# EAGLE design open-access-interlock (EAGLE 5.11)
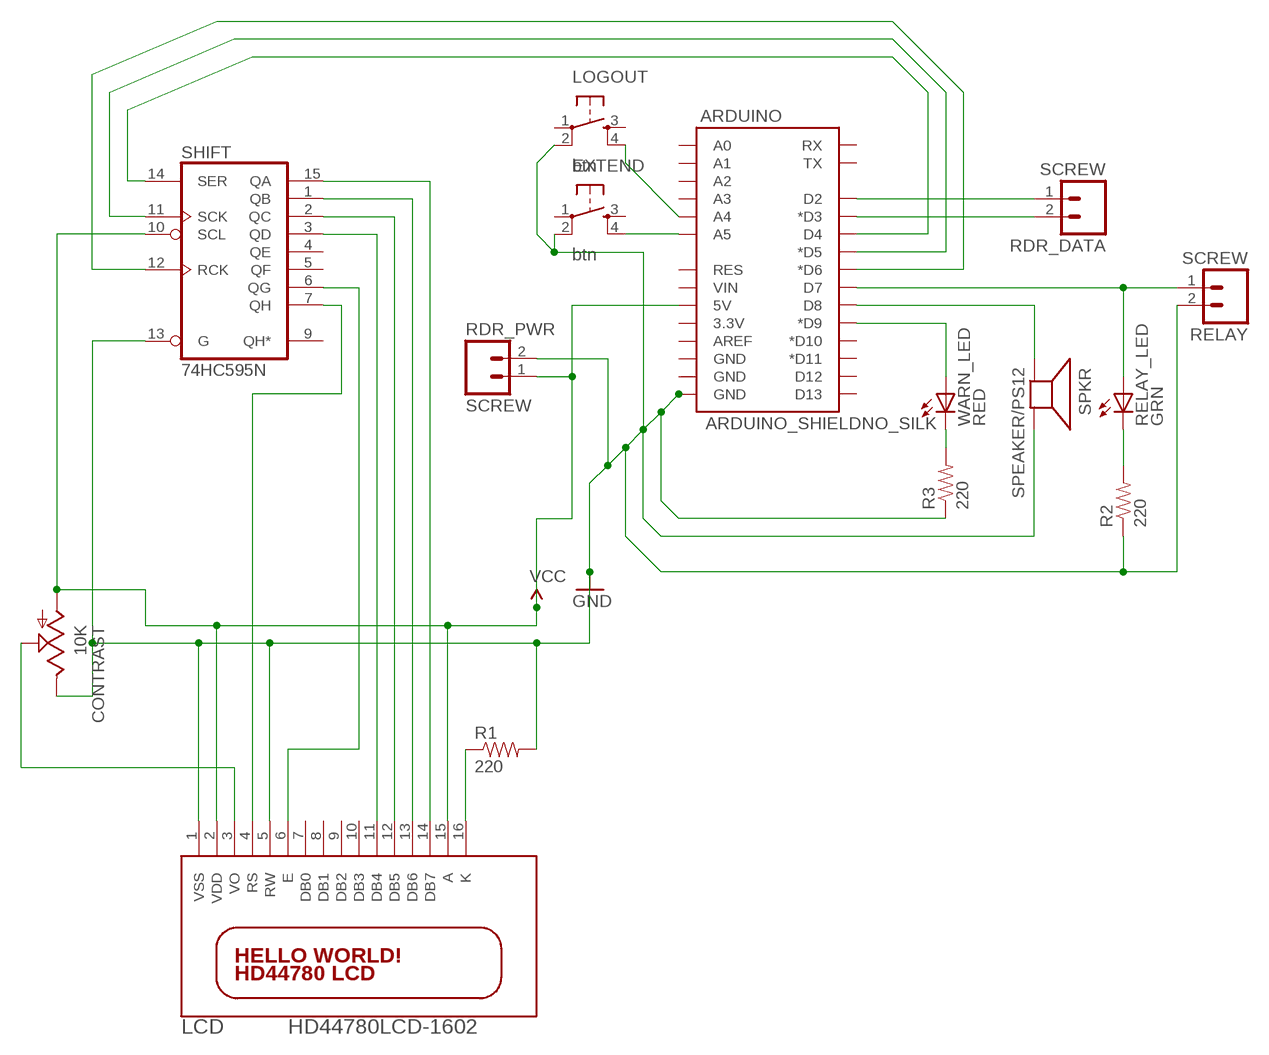
[diagram p0: schematic, sheet 1]

## Parts
ARDUINO  ARDUINO_SHIELDNO_SILK  [DUEMILANOVE_VIAS]
CONTRAST  10K  TRIM_US-RS3  [RS3]
EXTEND  btn  TAC_SWITCHPTH  [TACTILE-PTH]
LCD  HD44780LCD-1602  [LCD1602]
LOGOUT  btn  TAC_SWITCHPTH  [TACTILE-PTH]
R1  220  RESISTORAXIAL-0.3  [AXIAL-0.3]
R2  220  RESISTORAXIAL-0.3  [AXIAL-0.3]
R3  220  RESISTORAXIAL-0.3  [AXIAL-0.3]
RDR_DATA  SCREW  M023.5MM  [SCREWTERMINAL-3.5MM-2]
RDR_PWR  SCREW  M023.5MM  [SCREWTERMINAL-3.5MM-2]
RELAY  SCREW  M023.5MM  [SCREWTERMINAL-3.5MM-2]
RELAY_LED  GRN  LED5MM  [LED5MM]
SHIFT  74HC595N  [DIL16]
SPKR  SPEAKER/PS12  [PS12]
WARN_LED  RED  LED5MM  [LED5MM]

## Nets
GND: ARDUINO.GND@0(GND) CONTRAST.E EXTEND.2 LCD.1(VSS) LCD.5(RW) LOGOUT.2 R1.P$2 R2.P$1 R3.P$1 RDR_PWR.2 RELAY.2 SHIFT.13(G) SPKR.P$2(-)
N$1: ARDUINO.D2 RDR_DATA.1
N$2: ARDUINO.D3(*D3) RDR_DATA.2
N$3: LCD.13(DB6) SHIFT.1(QB)
N$4: LCD.12(DB5) SHIFT.2(QC)
N$5: ARDUINO.D4 SHIFT.14(SER)
N$6: ARDUINO.D6(*D6) SHIFT.12(RCK)
N$7: ARDUINO.D5(*D5) SHIFT.11(SCK)
N$8: ARDUINO.D7 RELAY.1 RELAY_LED.A
N$9: ARDUINO.D9(*D9) WARN_LED.A
N$10: ARDUINO.D8 SPKR.P$1(+)
N$11: LCD.6(E) SHIFT.6(QG)
N$12: LCD.11(DB4) SHIFT.3(QD)
N$14: ARDUINO.A4 LOGOUT.4
N$15: ARDUINO.A5 EXTEND.4
N$17: LCD.4(RS) SHIFT.7(QH)
N$18: CONTRAST.S LCD.3(VO)
N$19: LCD.16(K) R1.P$1
N$20: LCD.14(DB7) SHIFT.15(QA)
N$22: R3.P$2 WARN_LED.K(C)
N$23: R2.P$2 RELAY_LED.K(C)
VCC: ARDUINO.5V CONTRAST.A LCD.2(VDD) LCD.15(A) RDR_PWR.1 SHIFT.10(SCL)
Unconnected: ARDUINO.3.3V ARDUINO.A0 ARDUINO.A1 ARDUINO.A2 ARDUINO.A3 ARDUINO.AREF ARDUINO.D10(*D10) ARDUINO.D11(*D11) ARDUINO.D12 ARDUINO.D13 ARDUINO.GND@1(GND) ARDUINO.GND@2(GND) ARDUINO.RES ARDUINO.RX ARDUINO.TX ARDUINO.VIN EXTEND.1 EXTEND.3 LCD.7(DB0) LCD.8(DB1) LCD.9(DB2) LCD.10(DB3) LOGOUT.1 LOGOUT.3 SHIFT.4(QE) SHIFT.5(QF) SHIFT.9(QH*)

## Power pins joined to a net without a drawn wire
GND: SHIFT.8(GND)
VCC: SHIFT.16(VCC)

## Library data of the parts
ARDUINO = SparkFun:ARDUINO_SHIELD
CONTRAST = pot:TRIM_US-: POTENTIOMETER
EXTEND LOGOUT = SparkFun:TAC_SWITCH: Momentary Switch Button commonly used for reset or general input. Spark Fun Electronics SKU : COM-00097
LCD = adafruit:HD44780LCD: HD44780 LCD Standard character type LCDs, available in sizes from 8x1 to 40x4!
R1-R3 = SparkFun:RESISTOR: Resistor Basic schematic elements and footprints for 0603, 1206, and PTH resistors.
RDR_DATA RDR_PWR RELAY = SparkFun:M02: Header 2 Standard 2-pin 0.1" header. Use with straight break away headers (SKU : PRT-00116), right angle break away headers (PRT-00553), swiss pins (PRT-00743), machine pins (PRT-00117), and female headers (PRT-00115). Molex polarized connector foot print use with SKU : PRT-08233 with associated crimp pins and housings.
RELAY_LED WARN_LED = led:LED: LED OSRAM: - CHIPLED LG R971, LG N971, LY N971, LG Q971, LY Q971, LO R971, LY R971 LH N974, LH R974 LS Q976, LO Q976, LY Q976 LO Q996 - Hyper CHIPLED LW Q18S LB Q993, LB Q99A, LB R99A - SideLED LS A670, LO A670, LY A670, LG A670, LP A670 LB A673, LV A673, LT A673, LW A673 LH A674 LY A675 LS A676, LA A676, LO A676, LY A676, LW A676 LS A679, LY A679, LG A679 - Hyper Micro SIDELED® LS Y876, LA Y876, LO Y876, LY Y876 LT Y87S - SmartLED LW L88C, LW L88S LB L89C, LB L89S, LG L890 LS L89K, LO L89K, LY L89K LS L896, LA L896, LO L896, LY L896 - TOPLED LS T670, LO T670, LY T670, LG T670, LP T670 LSG T670, LSP T670, LSY T670, LOP T670, LYG T670 LG T671, LOG T671, LSG T671 LB T673, LV T673, LT T673, LW T673 LH T674 LS T676, LA T676, LO T676, LY T676, LB T676, LH T676, LSB T676, LW T676 LB T67C, LV T67C, LT T67C, LS T67K, LO T67K, LY T67K, LW E67C LS E67B, LA E67B, LO E67B, LY E67B, LB E67C, LV E67C, LT E67C LW T67C LS T679, LY T679, LG T679 LS T770, LO T770, LY T770, LG T770, LP T770 LB T773, LV T773, LT T773, LW T773 LH T774 LS E675, LA E675, LY E675, LS T675 LS T776, LA T776, LO T776, LY T776, LB T776 LHGB T686 LT T68C, LB T68C - Hyper Mini TOPLED® LB M676 - Mini TOPLED Santana® LG M470 LS M47K, LO M47K, LY M47K Source: http://www.osram.convergy.de LUXEON: - LUMILED® LXK2-PW12-R00, LXK2-PW12-S00, LXK2-PW14-U00, LXK2-PW14-V00 LXK2-PM12-R00, LXK2-PM12-S00, LXK2-PM14-U00 LXK2-PE12-Q00, LXK2-PE12-R00, LXK2-PE12-S00, LXK2-PE14-T00, LXK2-PE14-U00 LXK2-PB12-K00, LXK2-PB12-L00, LXK2-PB12-M00, LXK2-PB14-N00, LXK2-PB14-P00, LXK2-PB14-Q00 LXK2-PR12-L00, LXK2-PR12-M00, LXK2-PR14-Q00, LXK2-PR14-R00 LXK2-PD12-Q00, LXK2-PD12-R00, LXK2-PD12-S00 LXK2-PH12-R00, LXK2-PH12-S00 LXK2-PL12-P00, LXK2-PL12-Q00, LXK2-PL12-R00 Source: www.luxeon.com KINGBRIGHT: KA-3528ASYC Source: www.kingbright.com
SHIFT = 74xx-eu:74*595: 8-bit SHIFT REGISTER, output latch
SPKR = adafruit:SPEAKER: SPEAKER Source: Buerklin Added PS12 (for part # PS1240 piezo) http://www.ladyada.net/library/pcb/eaglelibrary.html

## Net classes
0 default: width 0.254 mm, drill 0.305 mm, clearance 0.203 mm

## Board
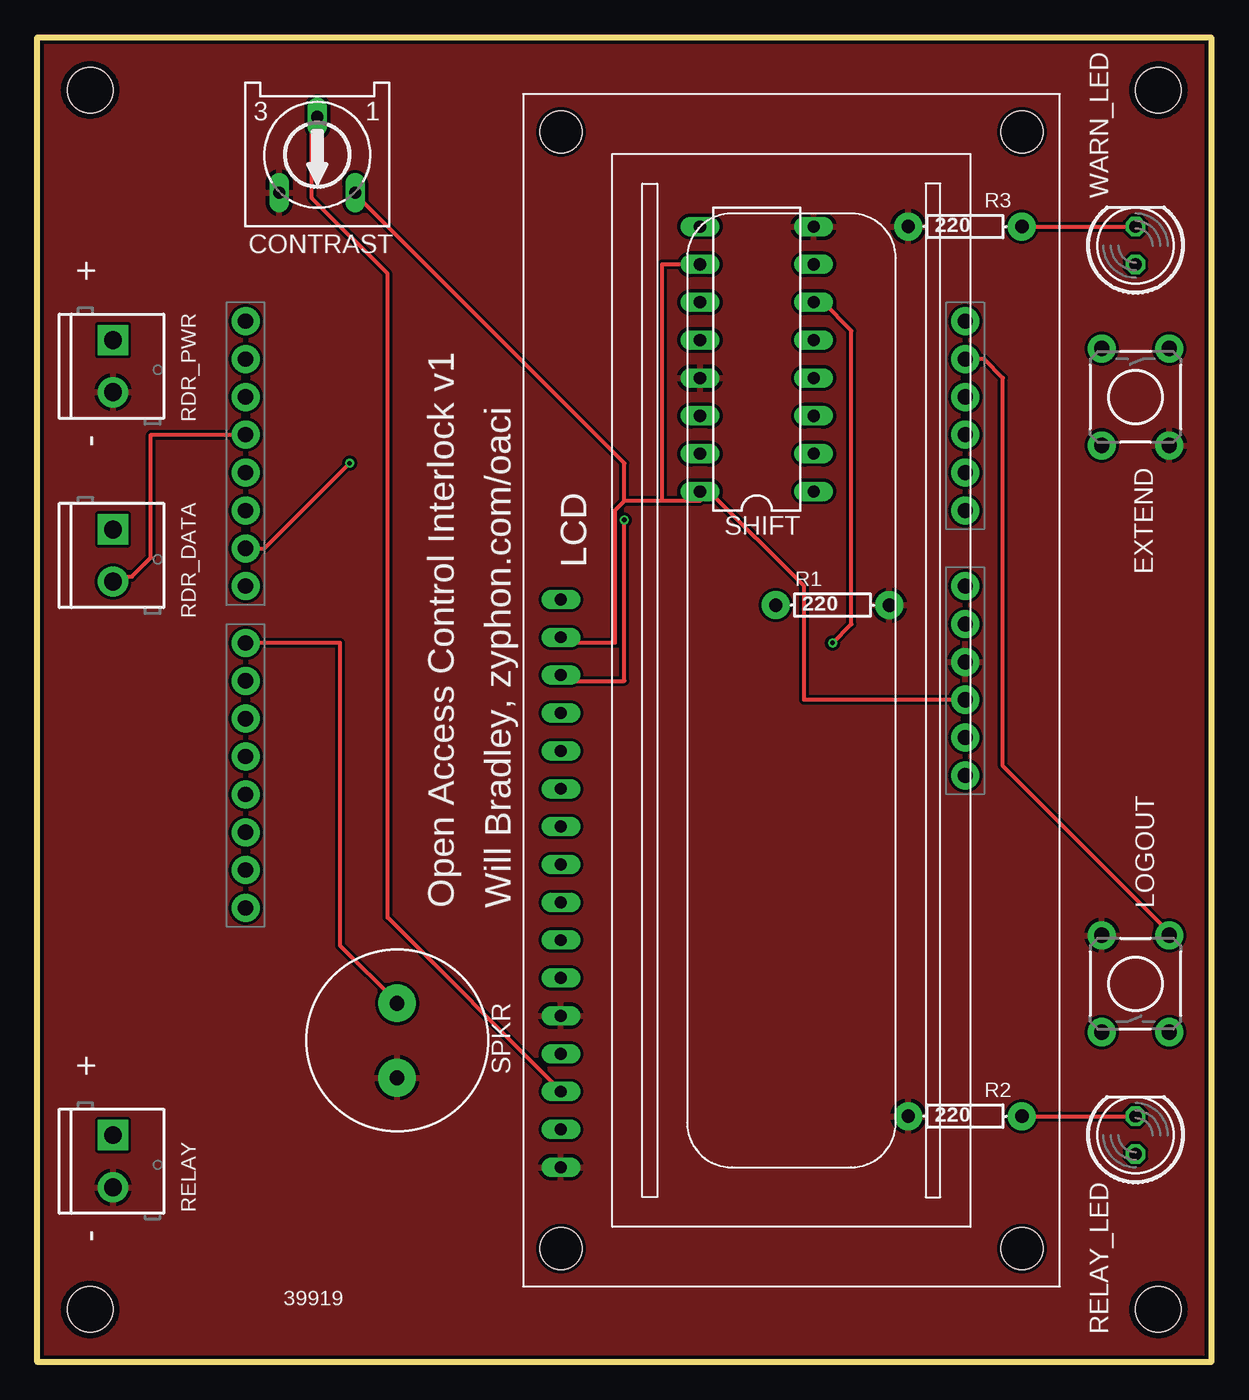
[diagram p1: board, top side]
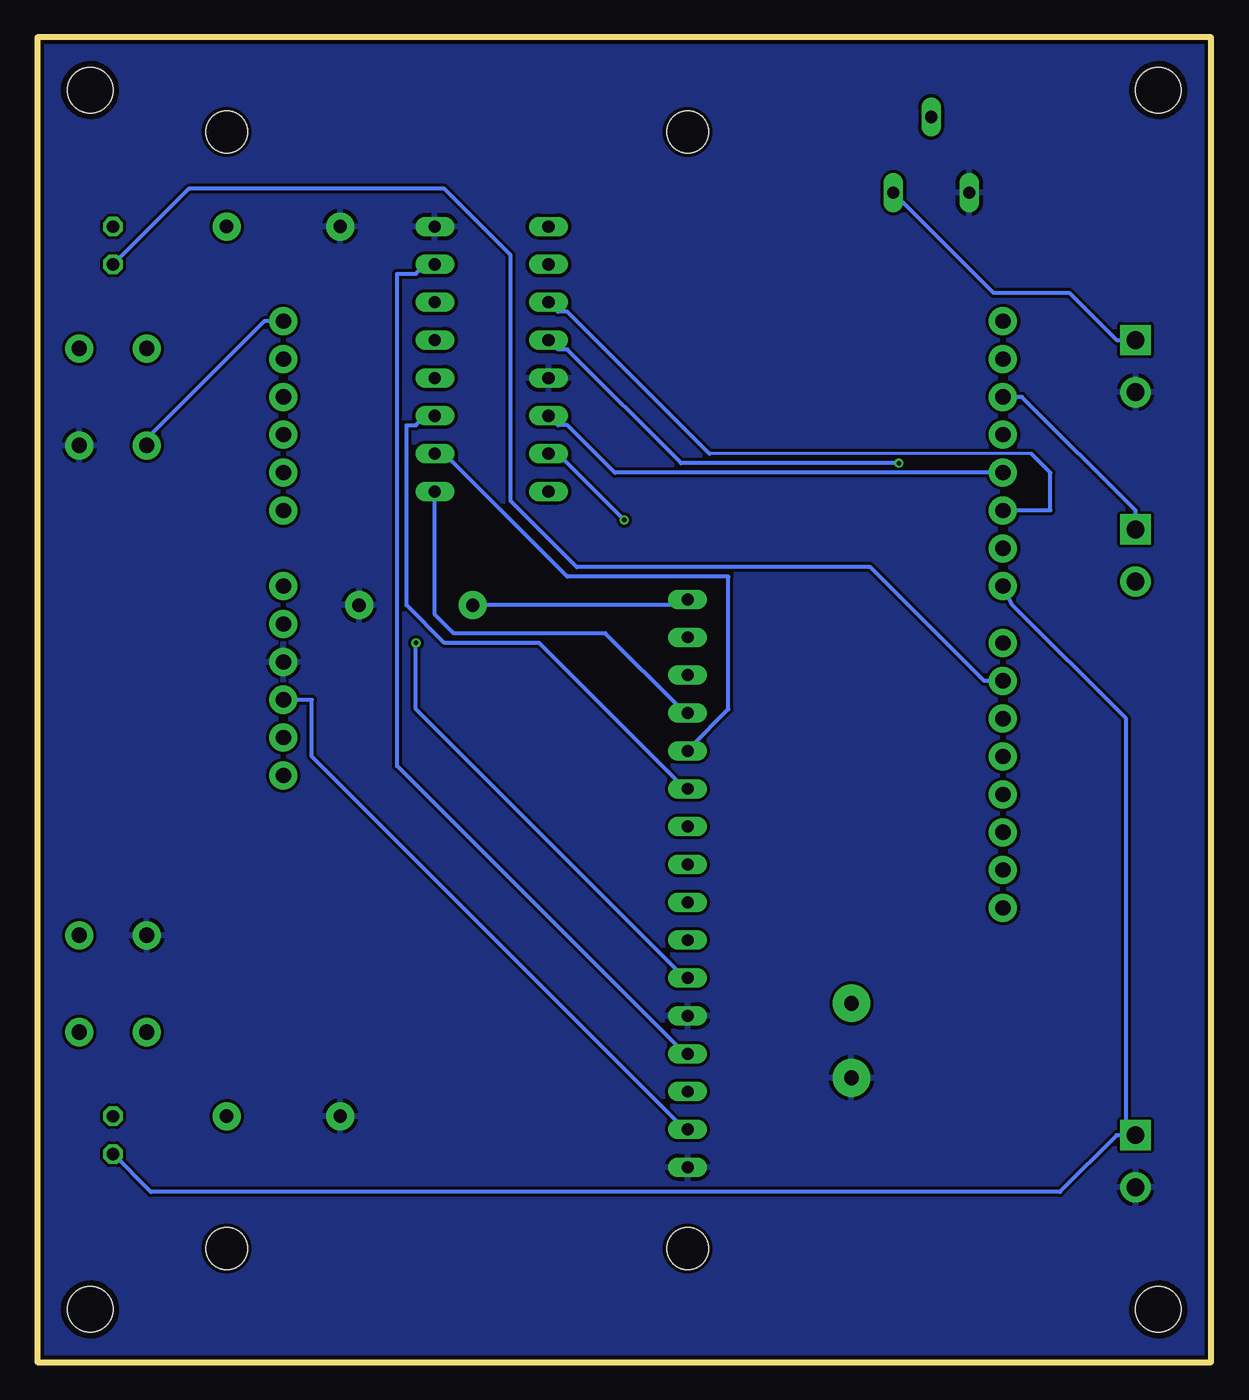
[diagram p2: board, bottom side, seen from below]

Size 78.74 x 88.9 mm. Coordinates in mm from the lower left corner, seen from the top.
Outline: 0,0 0,88.9 78.74,88.9 78.74,0 0,0
Copper layers (1*16): Top 0.035mm / dielectric 1.5mm / Bottom 0.035mm
Design rules "Fusion_eagle_rule_v1.1 *": minimum track width 6mil, minimum drill 12mil, track to track 6mil, track to pad 10mil, pad to pad 10mil, via to via 6mil, smd to smd 0mil, copper to edge 10mil, drill to drill 10mil, minimum pad ring 10mil, minimum via ring 6mil, stop-mask expansion 2mil, vias tented up to drill 100mil, thermal gap 10mil

### Footprints (pad centres in the part's own frame; a part is rotated, then mirrored left to right if it is on the bottom)
DUEMILANOVE_VIAS = drill 1.016 pad 1.88 round: 3.3V 50.8,13.97; 5V 50.8,16.51; A0 50.8,29.21; A1 50.8,31.75; A2 50.8,34.29; A3 50.8,36.83; A4 50.8,39.37; A5 50.8,41.91; AREF 2.54,2.54; D2 2.54,36.83; D3 2.54,34.29; D4 2.54,31.75; D5 2.54,29.21; D6 2.54,26.67; D7 2.54,24.13; D8 2.54,20.32; D9 2.54,17.78; D10 2.54,15.24; D11 2.54,12.7; D12 2.54,10.16; D13 2.54,7.62; GND@0 50.8,19.05; GND@1 50.8,21.59; GND@2 2.54,5.08; RES 50.8,11.43; RX 2.54,41.91; TX 2.54,39.37; VIN 50.8,24.13
RS3 = drill 0.813 long: A -2.54,2.54; E 2.54,2.54; S 0,-2.54
TACTILE-PTH = drill 1.016 pad 1.88 round: 1 -3.251,2.261; 2 3.251,2.261; 3 -3.251,-2.261; 4 3.251,-2.261
LCD1602 = drill 0.8 long: 1 8,33.46; 2 10.54,33.46; 3 13.08,33.46; 4 15.62,33.46; 5 18.16,33.46; 6 20.7,33.46; 7 23.24,33.46; 8 25.78,33.46; 9 28.32,33.46; 10 30.86,33.46; 11 33.4,33.46; 12 35.94,33.46; 13 38.48,33.46; 14 41.02,33.46; 15 43.56,33.46; 16 46.1,33.46 | hole 2.8: 2.54,2.54; 2.54,33.46; 77.46,33.46; 77.46,2.54
AXIAL-0.3 = drill 0.9 pad 1.88 round: P$1 -3.81,0; P$2 3.81,0
SCREWTERMINAL-3.5MM-2 = drill 1.2 pad 2.032 square: 1 0,0 | drill 1.2 pad 2.032 round: 2 3.5,0
LED5MM = drill 0.813 octagon: A -1.27,0; K 1.27,0
DIL16 = drill 0.813 long: 1 -8.89,-3.81; 2 -6.35,-3.81; 3 -3.81,-3.81; 4 -1.27,-3.81; 5 1.27,-3.81; 6 3.81,-3.81; 7 6.35,-3.81; 8 8.89,-3.81; 9 8.89,3.81; 10 6.35,3.81; 11 3.81,3.81; 12 1.27,3.81; 13 -1.27,3.81; 14 -3.81,3.81; 15 -6.35,3.81; 16 -8.89,3.81
PS12 = drill 1 pad 2.54 round: P$1 -2.5,0; P$2 2.5,0
STAND-OFF-TIGHT = hole 3.048: 0,0

### Placement (x,y rotation side)
ARDUINO  11.43,27.94 0 top
CONTRAST  18.78,81.01 180 top
EXTEND  73.66,64.77 270 top
LCD  68.58,5.08 90 top
LOGOUT  73.66,25.4 90 top
R1  53.34,50.8 0 top
R2  62.23,16.51 0 top
R3  62.23,76.2 0 top
RDR_DATA  5.08,55.88 270 top
RDR_PWR  5.08,68.58 270 top
RELAY  5.08,15.24 270 top
RELAY_LED  73.66,15.24 90 top
SHIFT  48.26,67.31 90 top
SPKR  24.13,21.59 270 top
U$2  [STAND-OFF-TIGHT]  75.2,3.54 0 top
U$3  [STAND-OFF-TIGHT]  3.54,3.54 0 top
U$4  [STAND-OFF-TIGHT]  3.54,85.36 0 top
U$5  [STAND-OFF-TIGHT]  75.2,85.36 0 top
WARN_LED  73.66,74.93 90 top

### Tracks (layer width: path | path; a pad name or v marks a point on that pad's centre or on a via)
GND
  pour Top: 90.17,-6.35 -7.7,-6.35 -10.16,96.52 89.98,96.52 89.98,94.71 90.17,92.71
  pour Bottom: 88.9,92.71 -8.89,92.71 -6.89,-6.08 88.9,-5.08
N$1
  Bottom 0.254: ARDUINO.D2 12.7,64.77 5.08,57.15 RDR_DATA.1
N$2
  Top 0.254: ARDUINO.D3 7.62,62.23 7.62,53.98 6.35,52.7 5.08,52.7 RDR_DATA.2
N$3
  Bottom 0.254: SHIFT.1 52.07,50.16 50.8,48.89 40.64,48.89 35.56,43.81 LCD.13
N$4
  Bottom 0.254: SHIFT.2 51.44,60.96 43.18,52.7 32.38,52.7 32.38,43.81 34.92,41.27 LCD.12
N$5
  Bottom 0.254: SHIFT.14 43.81,62.87 43.18,62.87 40.01,59.69 ARDUINO.D4
N$6  (via drill 0.3)
  Top 0.254: v20.95,60.32 15.24,54.61 ARDUINO.D6
  Bottom 0.254: SHIFT.12 43.81,67.95 43.18,67.95 35.56,60.32 v20.95,60.32
N$7
  Bottom 0.203: 12.06,60.96 33.66,60.96
  Bottom 0.254: SHIFT.11 43.81,70.48 43.18,70.48 33.66,60.96 | 12.06,60.96 10.79,59.69 10.79,57.15 ARDUINO.D5
N$8
  Bottom 0.254: RELAY_LED.A 71.12,11.43 10.16,11.43 6.35,15.24 5.71,15.24 | ARDUINO.D7 13.34,50.8 5.71,43.18 5.71,15.24 | RELAY.1 5.71,15.24
N$9
  Bottom 0.254: WARN_LED.A 68.58,78.74 51.44,78.74 46.99,74.3 46.99,57.78 42.55,53.34 22.86,53.34 15.24,45.72 ARDUINO.D9
N$10
  Top 0.254: ARDUINO.D8 20.32,48.26 20.32,27.94 24.13,24.13 SPKR.P$1
N$11  (via drill 0.3)
  Top 0.254: v53.34,48.26 54.61,49.53 54.61,69.22 52.7,71.12 SHIFT.6
  Bottom 0.254: v53.34,48.26 53.34,43.81 35.56,26.04 LCD.6
N$12
  Bottom 0.254: SHIFT.3 52.7,63.5 53.34,62.87 53.98,62.87 53.98,50.8 51.44,48.26 45.09,48.26 35.56,38.73 LCD.11
N$14
  Top 0.254: ARDUINO.A4 63.5,67.31 64.77,66.04 64.77,40.01 75.56,29.21 LOGOUT.4
N$15
  Bottom 0.254: ARDUINO.A5 63.5,69.85 71.75,61.59 EXTEND.4
N$17
  Bottom 0.254: SHIFT.7 52.7,73.66 53.34,73.03 54.61,73.03 54.61,40.01 35.56,20.95 LCD.4
N$18
  Top 0.254: LCD.3 34.92,18.41 23.5,29.84 23.5,73.03 18.41,78.11 18.41,83.19 CONTRAST.S
N$19
  Bottom 0.254: R1.P$1 35.56,50.8 LCD.16
N$20  (via drill 0.3)
  Top 0.254: v39.37,56.52 39.37,45.72 35.56,45.72 LCD.14
  Bottom 0.254: v39.37,56.52 43.81,60.96 SHIFT.15
N$22
  Top 0.254: R3.P$2 WARN_LED.K
N$23
  Top 0.254: R2.P$2 RELAY_LED.K
VCC
  Top 0.254: 39.37,57.78 38.73,57.15 38.73,48.26 35.56,48.26 LCD.15 | 41.91,57.78 44.45,57.78 SHIFT.16 45.09,58.42 51.44,52.07 51.44,44.45 ARDUINO.5V | 41.91,57.78 39.37,57.78 | SHIFT.10 41.91,73.66 41.91,57.78 | 39.37,57.78 39.37,60.32 21.59,78.11 CONTRAST.A
  Bottom 0.254: ARDUINO.5V 60.33,44.45 60.33,40.64 35.56,15.88 LCD.2 | RDR_PWR.1 6.35,68.58 9.53,71.76 14.61,71.76 CONTRAST.A

### Text on the board
tNames: + | - | LCD | Open Access Control Interlock v1 | Will Bradley, zyphon.com/oaci | + | - | 39919